# Altium schematic sheet I2C.SchDoc
size A4; DocumentNumber: 10; SheetNumber: 10; SheetTotal: 11
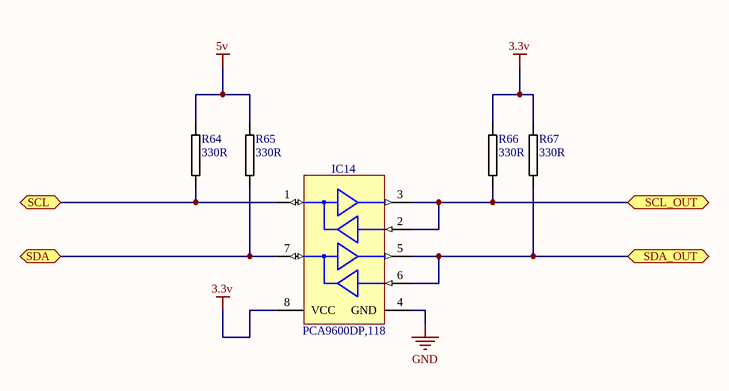
[diagram p0: I2C.SchDoc]

## Parts
IC14  PCA9600DP,118  [SOP65P490X110-8N]
R64  330R  [0805R-330]
R65  330R  [0805R-330]
R66  330R  [0805R-330]
R67  330R  [0805R-330]

## Ports
SCL, SCL_OUT, SDA, SDA_OUT

## Nets
3.3v: IC14.8(VCC) R66.1 R67.1
5v: R64.1 R65.1
GND: IC14.4(GND)
SCL: IC14.1(Sx) R64.2 ; port SCL
SCL_OUT: IC14.2(Rx) IC14.3(Tx) R66.2 ; port SCL_OUT
SDA: IC14.7(Sy) R65.2 ; port SDA
SDA_OUT: IC14.5(Ty) IC14.6(Ry) R67.2 ; port SDA_OUT

## Library data of the parts
IC14 = PCA9600DP,118: Dual Bidirectional Bus Buffer; Manufacturer: NXP SEMICONDUCTORS; Table: Analog & Interface; Part Number: PCA9600DP,118; Component Kind: Standard; Component Type: Standard; Device: PCA9600DP,118; PackageDescription: SOP, 0.65mm pitch; 8 pin, 3.00mm W X 3.00mm L X 1.10mm H body, IPC Medium Density; Part Description: Dual bidirectional bus buffer; Manufacturer Part Number: PCA9600DP,118; Pin Count: 8; Case: TSSOP8; Mounted: Yes; Socket: No; SMD: Yes; ComponentHeight: 1.1mm; Author: CERN DEM JLC; HelpURL: \\cern.ch\dfs\Applications\Altium\Datasheets\PCA9600DP,118.pdf; CreateDate: 05/10/2011; LatestRevisionDate: 23/08/2012
R64-R67 = 0805R-330: RESISTOR 0805 1/4 WATT THIN FILM; Reel: *